# EAGLE design IndustrialUSBtoModbus (EAGLE 9.7.0)
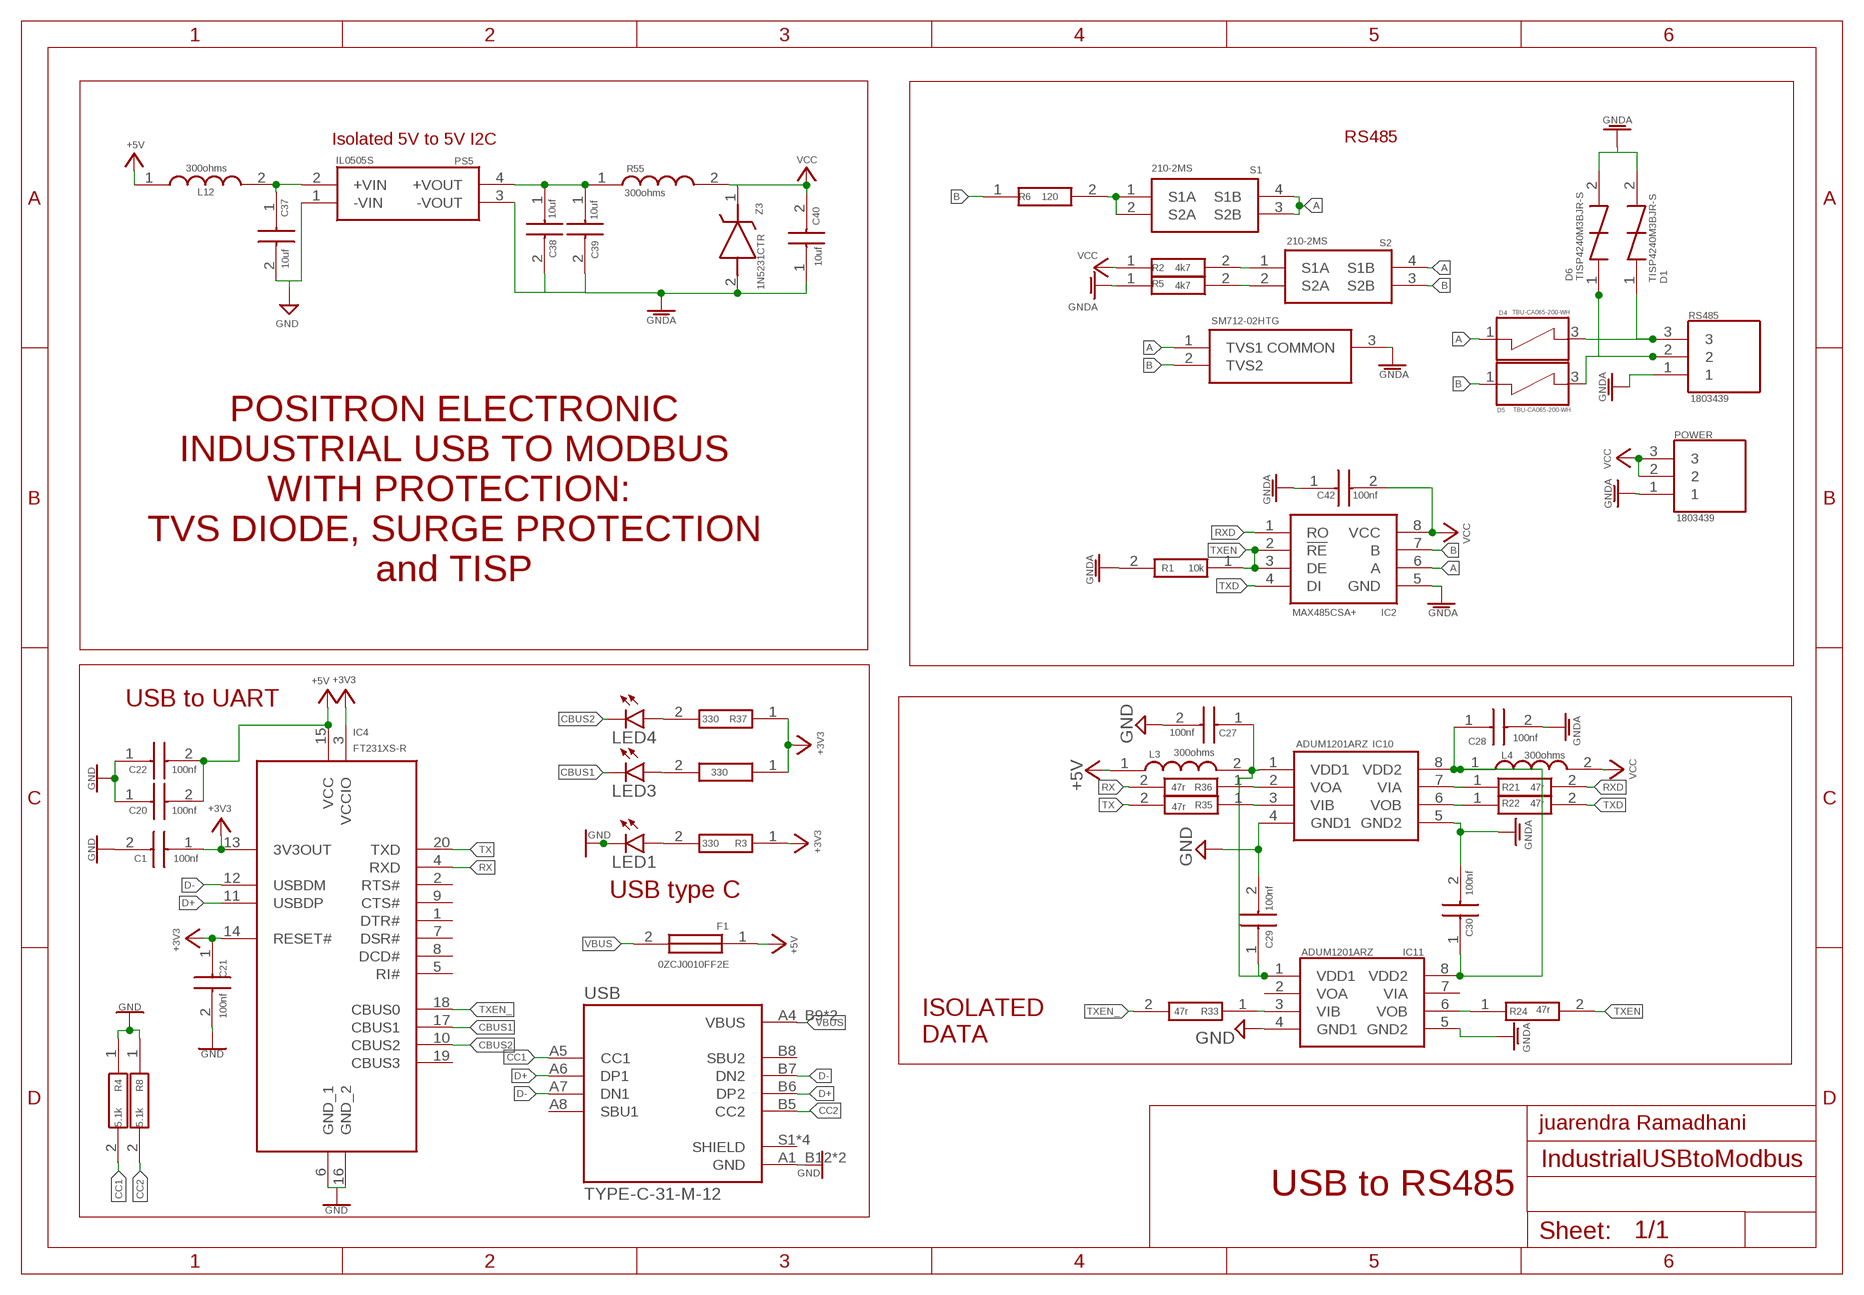
[diagram p0: schematic, sheet 1]

## Parts
C1  100nf  885012206071  [CAPC1608X87N]
C20  100nf  885012206071  [CAPC1608X87N]
C21  100nf  885012206071  [CAPC1608X87N]
C22  100nf  885012206071  [CAPC1608X87N]
C27  100nf  885012206071  [CAPC1608X87N]
C28  100nf  885012206071  [CAPC1608X87N]
C29  100nf  885012206071  [CAPC1608X87N]
C30  100nf  885012206071  [CAPC1608X87N]
C37  10uf  VJ1206G106KXXTW1BC  [CAPC3216X170N]
C38  10uf  VJ1206G106KXXTW1BC  [CAPC3216X170N]
C39  10uf  VJ1206G106KXXTW1BC  [CAPC3216X170N]
C40  10uf  VJ1206G106KXXTW1BC  [CAPC3216X170N]
C42  100nf  885012206071  [CAPC1608X87N]
D1  TISP4240M3BJR-S  [TISP4240M3BJRS]
D2  SM712-02HTG  [SOT95P237X111-3N]
D4  TBU-CA065-200-WH  [DIOC650X400X100N]
D5  TBU-CA065-200-WH  [DIOC650X400X100N]
D6  TISP4240M3BJR-S  [TISP4240M3BJRS]
F1  0ZCJ0010FF2E  [FUSC3216X75N]
IC2  MAX485CSA+  [SOIC127P600X175-8N]
IC4  FT231XS-R  [SOP64P599X175-20N]
IC10  ADUM1201ARZ  [SOIC127P600X175-8N]
IC11  ADUM1201ARZ  [SOIC127P600X175-8N]
L3  300ohms  MMZ1608B301CTAH0  [INDC1608X95N]
L4  300ohms  MMZ1608B301CTAH0  [INDC1608X95N]
L12  300ohms  MMZ1608B301CTAH0  [INDC1608X95N]
LED1  LED3MM  [LED3MM]
LED3  LED3MM  [LED3MM]
LED4  LED3MM  [LED3MM]
POWER  1803439  [1803439]
PS5  IL0505S  [IL0505S]
R1  10k  ERJ-3EKF1002V  [ERJ3EK_(0603)]
R2  4k7  ESR10EZPJ121  [RESC2012X65N]
R3  330  ERJ-H3EF3300V  [ERJH3]
R4  5.1k  ERJ-H3EF3300V  [ERJH3]
R5  4k7  ESR10EZPJ121  [RESC2012X65N]
R6  120  ESR10EZPJ121  [RESC2012X65N]
R8  5.1k  ERJ-H3EF3300V  [ERJH3]
R21  47r  ERJ-PA3J470V  [RESC1608X55N]
R22  47r  ERJ-PA3J470V  [RESC1608X55N]
R24  47r  ERJ-PA3J470V  [RESC1608X55N]
R33  47r  ERJ-PA3J470V  [RESC1608X55N]
R35  47r  ERJ-PA3J470V  [RESC1608X55N]
R36  47r  ERJ-PA3J470V  [RESC1608X55N]
R37  330  ERJ-H3EF3300V  [ERJH3]
R38  330  ERJ-H3EF3300V  [ERJH3]
R55  300ohms  MMZ1608B301CTAH0  [INDC1608X95N]
RS485  1803439  [1803439]
S1  210-2MS  [DIP775W63P254L655H458Q4N]
S2  210-2MS  [DIP775W63P254L655H458Q4N]
USB  TYPE-C-31-M-12  [HRO_TYPE-C-31-M-12]
Z3  1N5231CTR  [DIOAD1068W53L380D172]

## Nets
+3V3: C1.1 C21.1 IC4.3(VCCIO) IC4.13(3V3OUT) IC4.14(RESET#) R3.1 R37.1 R38.1
+5V: C20.2 C22.2 F1.1 IC4.15(VCC) L3.1 L12.1
A: D2.1(TVS1) D4.1 IC2.6(A) S1.3(S2B) S1.4(S1B) S2.4(S1B)
B: D2.2(TVS2) D5.1 IC2.7(B) R6.1 S2.3(S2B)
CBUS1: IC4.17(CBUS1) LED3.K(C)
CBUS2: IC4.10(CBUS2) LED4.K(C)
CC1: R4.2 USB.A5(CC1)
CC2: R8.2 USB.B5(CC2)
D+: IC4.11(USBDP) USB.A6(DP1) USB.B6(DP2)
D-: IC4.12(USBDM) USB.A7(DN1) USB.B7(DN2)
GND: C1.2 C20.1 C21.2 C22.1 C27.2 C29.2 C37.2 IC4.6(GND_1) IC4.16(GND_2) IC10.4(GND1) IC11.4(GND1) LED1.K(C) PS5.1(-VIN) R4.1 R8.1 USB.A1_B12(GND) USB.B1_A12(GND)
GNDA: C28.2 C30.2 C38.2 C39.2 C40.1 C42.1 D1.2 D2.3(COMMON) D6.2 IC2.5(GND) IC10.5(GND2) IC11.5(GND2) POWER.1 PS5.3(-VOUT) R1.2 R5.1 RS485.1 Z3.2(A)
N$1: C28.1 C30.1 IC10.8(VDD2) IC11.8(VDD2) L4.1
N$2: IC10.6(VOB) R22.1
N$3: LED3.A R38.2
N$4: IC10.7(VIA) R21.1
N$5: R2.2 S2.1(S1A)
N$6: R5.2 S2.2(S2A)
N$7: D5.3 D6.1 RS485.2
N$9: LED1.A R3.2
N$10: D1.1 D4.3 RS485.3
N$15: R6.2 S1.1(S1A) S1.2(S2A)
N$38: LED4.A R37.2
N$43: C27.1 C29.1 IC10.1(VDD1) IC11.1(VDD1) L3.2
N$47: IC10.3(VIB) R35.1
N$48: IC10.2(VOA) R36.1
N$54: IC11.6(VOB) R24.1
N$64: IC11.3(VIB) R33.1
N$85: C37.1 L12.2 PS5.2(+VIN)
N$86: C38.1 C39.1 PS5.4(+VOUT) R55.1
RX: IC4.4(RXD) R36.2
RXD: IC2.1(RO) R21.2
TX: IC4.20(TXD) R35.2
TXD: IC2.4(DI) R22.2
TXEN: IC2.2(!RE) IC2.3(DE) R1.1 R24.2
TXEN_: IC4.18(CBUS0) R33.2
VBUS: F1.2 USB.A4_B9(VBUS) USB.B4_A9(VBUS)
VCC: C40.2 C42.2 IC2.8(VCC) L4.2 POWER.2 POWER.3 R2.1 R55.2 Z3.1(K)
Unconnected: IC4.1(DTR#) IC4.2(RTS#) IC4.5(RI#) IC4.7(DSR#) IC4.8(DCD#) IC4.9(CTS#) IC4.19(CBUS3) IC11.2(VOA) IC11.7(VIA) USB.A8(SBU1) USB.B8(SBU2) USB.S1(SHIELD) USB.S2(SHIELD) USB.S3(SHIELD) USB.S4(SHIELD)

## Notes on the sheet
- Isolated 5V to 5V I2C | RS485
- POSITRON ELECTRONIC
  INDUSTRIAL USB TO MODBUS
  WITH PROTECTION: 
  TVS DIODE, SURGE PROTECTION
  and TISP
- USB to UART
- USB type C
- ISOLATED
  DATA
- juarendra Ramadhani
- USB to RS485

## Library data of the parts
C1 C20-C22 C42 = AKCP:885012206071: Wurth Elektronik 0603 WCAP-CSGP 100nF Ceramic Multilayer Capacitor, 25 V dc, +125C, X7R Dielectric, +/-10% Source: Datasheet <https://katalog.we-online.com/pbs/datasheet/885012206071.pdf>; DESCRIPTION: Wurth Elektronik 0603 WCAP-CSGP 100nF Ceramic Multilayer Capacitor, 25 V dc, +125C, X7R Dielectric, +/-10%; DIGIKEY_PARTNUMBER: 732-7989-1-ND; DIGIKEY_PRICE-STOCK: https://www.digikey.com/product-detail/en/w%C3%BCrth-elektronik/885012206071/732-7989-1-ND/5454616; HEIGHT: 0.87mm; MANUFACTURER_NAME: Wurth Elektronik; MANUFACTURER_PART_NUMBER: 885012206071; MOUSER_PART_NUMBER: 710-885012206071; MOUSER_PRICE-STOCK: https://www.mouser.co.uk/ProductDetail/Wurth-Elektronik/885012206071?qs=0KOYDY2FL2%2FEBQkuHgvarg%3D%3D
C27-C30 = Raritan Base:885012206071: Wurth Elektronik 0603 WCAP-CSGP 100nF Ceramic Multilayer Capacitor, 25 V dc, +125C, X7R Dielectric, +/-10% Source: Datasheet <https://katalog.we-online.com/pbs/datasheet/885012206071.pdf>; DESCRIPTION: Wurth Elektronik 0603 WCAP-CSGP 100nF Ceramic Multilayer Capacitor, 25 V dc, +125C, X7R Dielectric, +/-10%; DIGIKEY_PARTNUMBER: 732-7989-1-ND; DIGIKEY_PRICE-STOCK: https://www.digikey.com/product-detail/en/w%C3%BCrth-elektronik/885012206071/732-7989-1-ND/5454616; HEIGHT: 0.87mm; MANUFACTURER_NAME: Wurth Elektronik; MANUFACTURER_PART_NUMBER: 885012206071; MOUSER_PART_NUMBER: 710-885012206071; MOUSER_PRICE-STOCK: https://www.mouser.co.uk/ProductDetail/Wurth-Elektronik/885012206071?qs=0KOYDY2FL2%2FEBQkuHgvarg%3D%3D
C37-C40 = SamacSys_Parts:VJ1206G106KXXTW1BC: Multilayer Ceramic Capacitors MLCC - SMD/SMT 10uF 25volts 10% Source: Datasheet <http://www.vishay.com/docs/45200/vjhirelseries.pdf>; DESCRIPTION: Multilayer Ceramic Capacitors MLCC - SMD/SMT 10uF 25volts 10%; HEIGHT: 1.7mm; MANUFACTURER_NAME: Vishay; MANUFACTURER_PART_NUMBER: VJ1206G106KXXTW1BC; MOUSER_PART_NUMBER: 77-VJ126G106KXXTW1BC; MOUSER_PRICE-STOCK: https://www.mouser.co.uk/ProductDetail/Vishay-Vitramon/VJ1206G106KXXTW1BC?qs=%252BqhDFMvZazSFJ5Hhl5VYQw%3D%3D
D1 D6 = TISP4240M3BJR-S:TISP4240M3BJR-S: BOURNS - TISP4240M3BJR-S - THYRISTOR, O.VOLT. PROT., 180V, SMB Source: Datasheet <http://html.alldatasheet.com/html-pdf/160733/BOURNS/TISP4240M3BJR-S/2984/13/TISP4240M3BJR-S.html>; DESCRIPTION: BOURNS - TISP4240M3BJR-S - THYRISTOR, O.VOLT. PROT., 180V, SMB; HEIGHT: 2.4mm; MANUFACTURER_NAME: Bourns; MANUFACTURER_PART_NUMBER: TISP4240M3BJR-S; MOUSER_PART_NUMBER: 652-TISP4240M3BJR-S; MOUSER_PRICE-STOCK: https://www.mouser.co.uk/ProductDetail/Bourns/TISP4240M3BJR-S?qs=0zoXPJiSMmNlDn5QEdP1vg%3D%3D
D2 = SamacSys_Parts:SM712-02HTG: ESD Suppressors / TVS Diodes 600W 2 Channel Green Asymmetrical SOT23-3 Source: Datasheet; DESCRIPTION: ESD Suppressors / TVS Diodes 600W 2 Channel Green Asymmetrical SOT23-3; DIGIKEY_PARTNUMBER: F6450CT-ND; DIGIKEY_PRICE-STOCK: https://www.digikey.com/product-detail/en/littelfuse-inc/SM712-02HTG/F6450CT-ND/5019610; HEIGHT: 1.11mm; MANUFACTURER_NAME: LITTELFUSE; MANUFACTURER_PART_NUMBER: SM712-02HTG; MOUSER_PART_NUMBER: 576-SM712-02HTG; MOUSER_PRICE-STOCK: https://www.mouser.co.uk/ProductDetail/Littelfuse/SM712-02HTG?qs=aGgfWYEhH7lQgBVBPCUDkw%3D%3D
D4 D5 = TBU-CA065-200-WH:TBU-CA065-200-WH: TBU-CA065-200-WH, Bi-Directional TVS Diode, 12-Pin DFN Check availability <https://pricing.snapeda.com/parts/TBU-CA065-200-WH/Bourns/view-part?ref=eda>; AVAILABILITY: In Stock; CHECK_PRICES: https://www.snapeda.com/parts/TBU-CA065-200-WH/Bourns+-+J.W.+Miller/view-part/?ref=eda; DESCRIPTION: A Single Bi-Directional, 650V, 200mA, 3-Pin DFN pkg TBU | Bourns TBU-CA065-200-WH; MF: Bourns; MP: TBU-CA065-200-WH; PACKAGE: SMD-4 Bourns; PRICE: None; PURCHASE-URL: https://www.snapeda.com/api/url_track_click_mouser/?unipart_id=587286&manufacturer=Bourns&part_name=TBU-CA065-200-WH&search_term=None; SNAPEDA_LINK: https://www.snapeda.com/parts/TBU-CA065-200-WH/Bourns+-+J.W.+Miller/view-part/?ref=snap
F1 = AccesControlNFC:0ZCJ0010FF2E: Resettable Fuses - PPTC Fuse Source: Datasheet <https://componentsearchengine.com/Datasheets/1/0ZCJ0010FF2E.pdf>; DESCRIPTION: Resettable Fuses - PPTC Fuse; HEIGHT: 0.75mm; MANUFACTURER_NAME: Stewart Connector; MANUFACTURER_PART_NUMBER: 0ZCJ0010FF2E; MOUSER_PART_NUMBER: 530-0ZCJ0010FF2E; MOUSER_PRICE-STOCK: https://www.mouser.co.uk/ProductDetail/Bel-Fuse/0ZCJ0010FF2E?qs=SRYZG9HaIQ2ZPdy0ahZ08g%3D%3D
IC2 = AKCP:MAX485CSA+: MAX485CSA+, Line Transceiver, RS-485, RS-422 2.5Mbit/s Differential, 5V, 8-Pin SOIC Source: Datasheet <http://datasheets.maximintegrated.com/en/ds/MAX1487-MAX491.pdf>; DESCRIPTION: MAX485CSA+, Line Transceiver, RS-485, RS-422 2.5Mbit/s Differential, 5V, 8-Pin SOIC; HEIGHT: 1.75mm; MANUFACTURER_NAME: Maxim Integrated; MANUFACTURER_PART_NUMBER: MAX485CSA+; MOUSER_PART_NUMBER: 700-MAX485CSA; MOUSER_PRICE-STOCK: https://www.mouser.co.uk/ProductDetail/Maxim-Integrated/MAX485CSA%2b?qs=1THa7WoU59EQmpurcwoy4Q%3D%3D
IC4 = AKCP:FT231XS-R: FTDI Chip FT231XS-R, Interface RS232, RS422, RS485, SIE, UART 3MBd, 5 V, 20-pin, SSOP Source: Datasheet; DESCRIPTION: FTDI Chip FT231XS-R, Interface RS232, RS422, RS485, SIE, UART 3MBd, 5 V, 20-pin, SSOP; HEIGHT: 1.753mm; MANUFACTURER_NAME: FTDI Chip; MANUFACTURER_PART_NUMBER: FT231XS-R; MOUSER_PART_NUMBER: 895-FT231XS-R; MOUSER_PRICE-STOCK: https://www.mouser.co.uk/ProductDetail/FTDI/FT231XS-R?qs=Gp1Yz1mis3WduRPsgrTbtg%3D%3D
IC10 IC11 = Raritan Base:ADUM1201ARZ: Dual-Channel Digital Isolators Source: Datasheet <http://componentsearchengine.com/Datasheets/1/ADUM1201ARZ.pdf>; DESCRIPTION: Dual-Channel Digital Isolators; HEIGHT: 1.75mm; MANUFACTURER_NAME: Analog Devices; MANUFACTURER_PART_NUMBER: ADUM1201ARZ; MOUSER_PART_NUMBER: 584-ADUM1201ARZ; MOUSER_PRICE-STOCK: https://www.mouser.co.uk/ProductDetail/Analog-Devices/ADUM1201ARZ?qs=WIvQP4zGanhnZkk5OvV4Vw%3D%3D
L3 L4 L12 R55 = Raritan Base:MMZ1608B301CTAH0: Ferrite Beads Multi-Layer 300Ohm 25% 100MHz 500mA 250mOhm DCR 0603 T/R Source: Datasheet <https://www.arrow.com/en/products/mmz1608b301ctah0/tdk>; ARROW_PART_NUMBER: MMZ1608B301CTAH0; DESCRIPTION: Ferrite Beads Multi-Layer 300Ohm 25% 100MHz 500mA 250mOhm DCR 0603 T/R; HEIGHT: 0.95mm; MANUFACTURER_NAME: TDK; MANUFACTURER_PART_NUMBER: MMZ1608B301CTAH0
LED1 LED3 LED4 = led:LED: LED OSRAM: - CHIPLED LG R971, LG N971, LY N971, LG Q971, LY Q971, LO R971, LY R971 LH N974, LH R974 LS Q976, LO Q976, LY Q976 LO Q996 - Hyper CHIPLED LW Q18S LB Q993, LB Q99A, LB R99A - SideLED LS A670, LO A670, LY A670, LG A670, LP A670 LB A673, LV A673, LT A673, LW A673 LH A674 LY A675 LS A676, LA A676, LO A676, LY A676, LW A676 LS A679, LY A679, LG A679 - Hyper Micro SIDELED® LS Y876, LA Y876, LO Y876, LY Y876 LT Y87S - SmartLED LW L88C, LW L88S LB L89C, LB L89S, LG L890 LS L89K, LO L89K, LY L89K LS L896, LA L896, LO L896, LY L896 - TOPLED LS T670, LO T670, LY T670, LG T670, LP T670 LSG T670, LSP T670, LSY T670, LOP T670, LYG T670 LG T671, LOG T671, LSG T671 LB T673, LV T673, LT T673, LW T673 LH T674 LS T676, LA T676, LO T676, LY T676, LB T676, LH T676, LSB T676, LW T676 LB T67C, LV T67C, LT T67C, LS T67K, LO T67K, LY T67K, LW E67C LS E67B, LA E67B, LO E67B, LY E67B, LB E67C, LV E67C, LT E67C LW T67C LS T679, LY T679, LG T679 LS T770, LO T770, LY T770, LG T770, LP T770 LB T773, LV T773, LT T773, LW T773 LH T774 LS E675, LA E675, LY E675, LS T675 LS T776, LA T776, LO T776, LY T776, LB T776 LHGB T686 LT T68C, LB T68C - Hyper Mini TOPLED® LB M676 - Mini TOPLED Santana® LG M470 LS M47K, LO M47K, LY M47K Source: http://www.osram.convergy.de LUXEON: - LUMILED® LXK2-PW12-R00, LXK2-PW12-S00, LXK2-PW14-U00, LXK2-PW14-V00 LXK2-PM12-R00, LXK2-PM12-S00, LXK2-PM14-U00 LXK2-PE12-Q00, LXK2-PE12-R00, LXK2-PE12-S00, LXK2-PE14-T00, LXK2-PE14-U00 LXK2-PB12-K00, LXK2-PB12-L00, LXK2-PB12-M00, LXK2-PB14-N00, LXK2-PB14-P00, LXK2-PB14-Q00 LXK2-PR12-L00, LXK2-PR12-M00, LXK2-PR14-Q00, LXK2-PR14-R00 LXK2-PD12-Q00, LXK2-PD12-R00, LXK2-PD12-S00 LXK2-PH12-R00, LXK2-PH12-S00 LXK2-PL12-P00, LXK2-PL12-Q00, LXK2-PL12-R00 Source: www.luxeon.com KINGBRIGHT: KA-3528ASYC Source: www.kingbright.com
POWER RS485 = 1803439:1803439: 3 way vertical PCB header,3.81mm pitch Phoenix Contact MCV Series, 3.81mm Pitch 3 Way 1 Row Straight PCB Header, Solder Termination, 8A Source: Datasheet; DESCRIPTION: 3 way vertical PCB header,3.81mm pitch Phoenix Contact MCV Series, 3.81mm Pitch 3 Way 1 Row Straight PCB Header, Solder Termination, 8A; HEIGHT: mm; MANUFACTURER_NAME: Phoenix Contact; MANUFACTURER_PART_NUMBER: 1803439; MOUSER_PART_NUMBER: 651-1803439; MOUSER_PRICE-STOCK: https://www.mouser.co.uk/ProductDetail/Phoenix-Contact/1803439?qs=ChwaSN6Xm4%2FKqu7eZUAe4w%3D%3D
PS5 = IL0505S:IL0505S: DC/DC Converter Isolated 5V 2W XP Power Through Hole 2W Isolated DC-DC Converter, Vin 4.5 5.5 V dc, I/O isolation 1000V dc, Vout 5V dc Source: Datasheet <https://www.xppower.com/portals/0/pdfs/SF_IL.pdf>; DESCRIPTION: DC/DC Converter Isolated 5V 2W XP Power Through Hole 2W Isolated DC-DC Converter, Vin 4.5 5.5 V dc, I/O isolation 1000V dc, Vout 5V dc; HEIGHT: mm; MANUFACTURER_NAME: XP POWER; MANUFACTURER_PART_NUMBER: IL0505S; MOUSER_PART_NUMBER: 209-IL0505S; MOUSER_PRICE-STOCK: https://www.mouser.co.uk/ProductDetail/XP-Power/IL0505S?qs=w%2Fv1CP2dgqqMDzpB%252BgTJVA%3D%3D
R1 = AKCP:ERJ-3EKF1002V: Thick Film Resistors - SMD 0603 10Kohms 1% AEC-Q200 Source: Datasheet <https://industrial.panasonic.com/cdbs/www-data/pdf/RDA0000/AOA0000C304.pdf>; DESCRIPTION: Thick Film Resistors - SMD 0603 10Kohms 1% AEC-Q200; HEIGHT: 0.55mm; MANUFACTURER_NAME: Panasonic; MANUFACTURER_PART_NUMBER: ERJ-3EKF1002V; MOUSER_PART_NUMBER: 667-ERJ-3EKF1002V; MOUSER_PRICE-STOCK: https://www.mouser.co.uk/ProductDetail/Panasonic/ERJ-3EKF1002V?qs=H7k1u0Mp9JSrGPQ5%2F5COuw%3D%3D
R2 R5 R6 = SamacSys_Parts:ESR10EZPJ121: Thick Film Resistors - SMD 0805 120ohm 5% Anti Surge AEC-Q200 Source: Datasheet <https://ms.componentsearchengine.com/Datasheets/1/ESR10EZPJ121.pdf>; ARROW_PART_NUMBER: ESR10EZPJ121; DESCRIPTION: Thick Film Resistors - SMD 0805 120ohm 5% Anti Surge AEC-Q200; DIGIKEY_PARTNUMBER: RHM120KCT-ND; DIGIKEY_PRICE-STOCK: https://www.digikey.com/product-detail/en/rohm-semiconductor/ESR10EZPJ121/RHM120KCT-ND/1762959; HEIGHT: 0.65mm; MANUFACTURER_NAME: ROHM Semiconductor; MANUFACTURER_PART_NUMBER: ESR10EZPJ121; MOUSER_PART_NUMBER: 755-ESR10EZPJ121; MOUSER_PRICE-STOCK: https://www.mouser.co.id/ProductDetail/ROHM-Semiconductor/ESR10EZPJ121?qs=%2Fha2pyFadui7JatYYUNpFhsZLPns7z%252BGDgMyY6tORV%2FueGFgrTXlFg%3D%3D; SPICEPREFIX: R
R3 R37 R38 = AKCP:ERJ-H3EF3300V: Power Rating 0.125W,Resistance 330 Ohm,LxW(EIA) 1.6 x 0.8 (EIA:0603) mm Source: Datasheet <http://industrial.panasonic.com/cdbs/www-data/pdf/RDQ0000/ast-ind-151033.pdf>; DESCRIPTION: Power Rating 0.125W,Resistance 330 Ohm,LxW(EIA) 1.6 x 0.8 (EIA:0603) mm; HEIGHT: mm; MANUFACTURER_NAME: Panasonic; MANUFACTURER_PART_NUMBER: ERJ-H3EF3300V; MOUSER_PART_NUMBER: 667-ERJ-H3EF3300V; MOUSER_PRICE-STOCK: https://www.mouser.co.uk/ProductDetail/Panasonic/ERJ-H3EF3300V?qs=eP2BKZSCXI61roRLPi8W7w%3D%3D
R4 R8 = AKCP:ERJ-H3EF3300V: Power Rating 0.125W,Resistance 330 Ohm,LxW(EIA) 1.6 x 0.8 (EIA:0603) mm Source: Datasheet <http://industrial.panasonic.com/cdbs/www-data/pdf/RDQ0000/ast-ind-151033.pdf>; DESCRIPTION: Power Rating 0.125W,Resistance 330 Ohm,LxW(EIA) 1.6 x 0.8 (EIA:0603) mm; HEIGHT: mm; MANUFACTURER_NAME: Panasonic; MANUFACTURER_PART_NUMBER: ERJ-H3EF3300V; MOUSER_PART_NUMBER: 667-ERJ-H3EF3300V; MOUSER_PRICE-STOCK: https://www.mouser.co.uk/ProductDetail/Panasonic/ERJ-H3EF3300V?qs=eP2BKZSCXI61roRLPi8W7w%3D%3D; VALUE: 330
R21 R22 R24 R33 R35 R36 = Raritan Base:ERJ-PA3J470V: ERJ-PA3J470V Source: Datasheet <https://industrial.panasonic.com/cdbs/www-data/pdf/RDO0000/AOA0000C331.pdf>; DESCRIPTION: ERJ-PA3J470V; DIGIKEY_PARTNUMBER: P47.00BZCT-ND; DIGIKEY_PRICE-STOCK: https://www.digikey.com/product-detail/en/panasonic-electronic-components/ERJ-PA3J470V/P47-00BZCT-ND/5036330; HEIGHT: 0.55mm; MANUFACTURER_NAME: Panasonic; MANUFACTURER_PART_NUMBER: ERJ-PA3J470V; MOUSER_PART_NUMBER: 667-ERJ-PA3J470V; MOUSER_PRICE-STOCK: https://www.mouser.co.id/ProductDetail/Panasonic/ERJ-PA3J470V?qs=%2Fha2pyFadujfhmhVngkC6%252BrB%252BD0htnOagRQnEO%2FGREZyJH21elijFg%3D%3D
S1 S2 = SamacSys_Parts:210-2MS: DIP Switches / SIP Switches 2 switch sections SPST Source: Datasheet <https://componentsearchengine.com/Datasheets/1/210-2MS.pdf>; DESCRIPTION: DIP Switches / SIP Switches 2 switch sections SPST; HEIGHT: 4.58mm; MANUFACTURER_NAME: CTS; MANUFACTURER_PART_NUMBER: 210-2MS; MOUSER_PART_NUMBER: 774-2102MS; MOUSER_PRICE-STOCK: https://www.mouser.com/Search/Refine.aspx?Keyword=774-2102MS; SPICEPREFIX: S
USB = TYPE-C-31-M-12:TYPE-C-31-M-12: Check availability <https://pricing.snapeda.com/parts/TYPE-C-31-M-12/HRO%20Electronics%20Co.%2C%20Ltd./view-part?ref=eda>; AVAILABILITY: Not in stock; CHECK_PRICES: https://www.snapeda.com/parts/TYPE-C-31-M-12/HRO+Electronics+Co.%252C+Ltd./view-part/?ref=eda; DESCRIPTION: USB Connectors 24 Receptacle 1 8.94*7.3mm RoHS; MF: HRO Electronics Co., Ltd.; MP: TYPE-C-31-M-12; PACKAGE: Package; PRICE: None; SNAPEDA_LINK: https://www.snapeda.com/parts/TYPE-C-31-M-12/HRO+Electronics+Co.%252C+Ltd./view-part/?ref=snap
Z3 = SamacSys_Parts:1N5231CTR: Zener Diodes Source: Datasheet <https://componentsearchengine.com/Datasheets/1/1N5231CTR.pdf>; DESCRIPTION: Zener Diodes; DIGIKEY_PARTNUMBER: 1N5231CTRCT-ND; DIGIKEY_PRICE-STOCK: https://www.digikey.com/product-detail/en/on-semiconductor/1N5231CTR/1N5231CTRCT-ND/3907881; HEIGHT: mm; MANUFACTURER_NAME: ON Semiconductor; MANUFACTURER_PART_NUMBER: 1N5231CTR; MOUSER_PART_NUMBER: 512-1N5231CTR; MOUSER_PRICE-STOCK: https://www.mouser.com/Search/Refine.aspx?Keyword=512-1N5231CTR

## Board
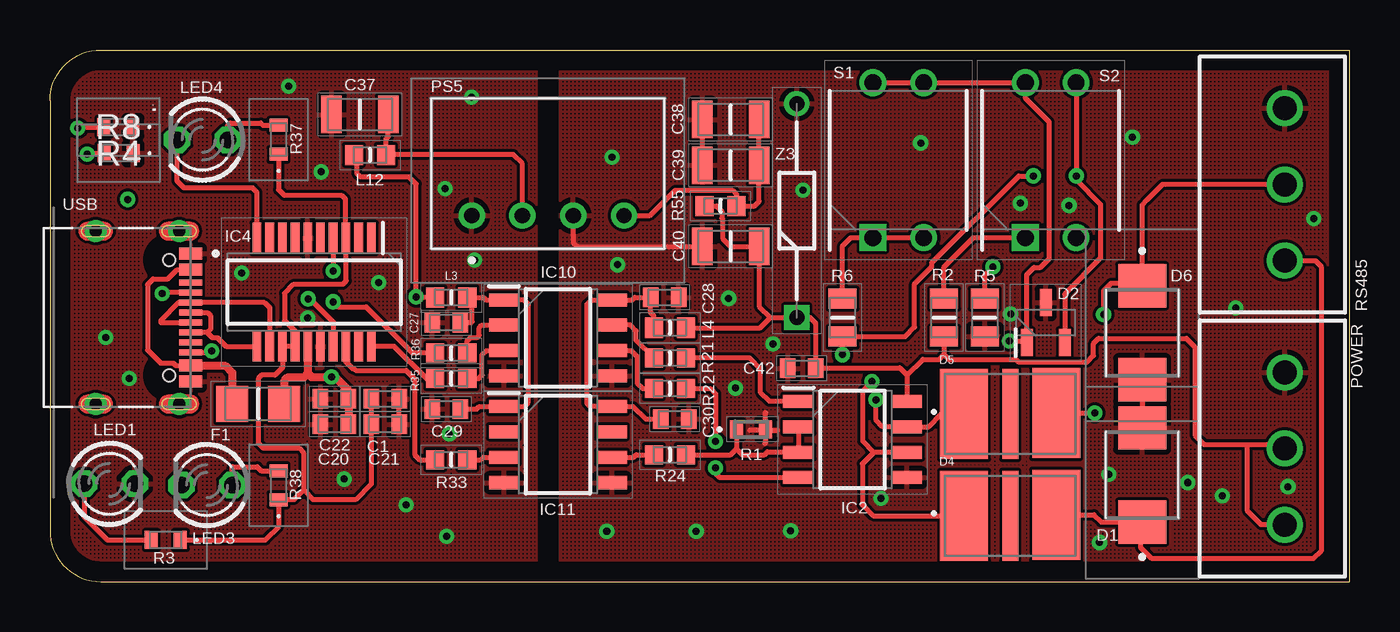
[diagram p1: board, top side]
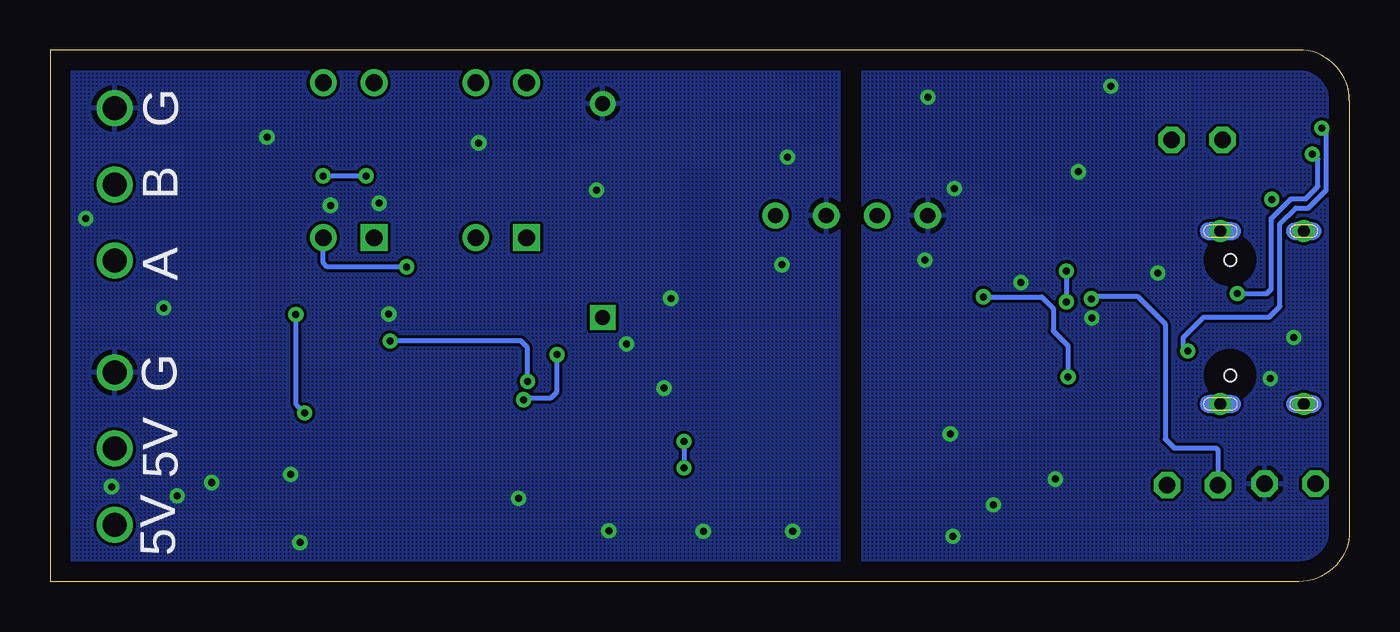
[diagram p2: board, bottom side, seen from below]

Size 64.97 x 26.59 mm. Coordinates in mm from the lower left corner, seen from the top.
Outline: 2.54,0 64.97,0 64.97,26.59 2.54,26.59 arc90 0,24.05 0,2.54 arc90 2.54,0
Copper layers (1*16): Top 0.035mm / dielectric 1.5mm / Bottom 0.035mm
Design rules "Fusion Electronics Design Rules": minimum track width 10mil, minimum drill 0.35mm, track to track 6mil, track to pad 6mil, pad to pad 6mil, via to via 6mil, smd to smd 6mil, copper to edge 40mil, drill to drill 6mil, minimum pad ring 10mil, minimum via ring 8mil, stop-mask expansion 4mil, vias tented up to drill 0.36mm, thermal gap 10mil

### Footprints (pad centres in the part's own frame; a part is rotated, then mirrored left to right if it is on the bottom)
CAPC1608X87N = smd 0.78 x 0.98: 1 -0.7,0; 2 0.7,0
CAPC3216X170N = smd 1.03 x 1.87: 1 -1.42,0; 2 1.42,0
TISP4240M3BJRS = smd 2.16 x 2.4: 1 -2.35,0; 2 2.35,0
SOT95P237X111-3N = smd 1.35 x 0.6: 1 -1,0.95; 2 -1,-0.95; 3 1,0
DIOC650X400X100N = smd 2.4 x 4.5: 1 -2.3,0; 3 2.3,0.05 | smd 0.8 x 4.5: 2 0,0
FUSC3216X75N = smd 1.61 x 1.82: 1 -1.3,0; 2 1.3,0
SOIC127P600X175-8N = smd 1.525 x 0.65: 1 -2.712,1.905; 2 -2.712,0.635; 3 -2.712,-0.635; 4 -2.712,-1.905; 5 2.712,-1.905; 6 2.712,-0.635; 7 2.712,0.635; 8 2.712,1.905
SOP64P599X175-20N = smd 1.526 x 0.435: 1 -2.712,2.858; 2 -2.712,2.222; 3 -2.712,1.588; 4 -2.712,0.952; 5 -2.712,0.318; 6 -2.712,-0.318; 7 -2.712,-0.952; 8 -2.712,-1.588; 9 -2.712,-2.222; 10 -2.712,-2.858; 11 2.712,-2.858; 12 2.712,-2.222; 13 2.712,-1.588; 14 2.712,-0.952; 15 2.712,-0.318; 16 2.712,0.318; 17 2.712,0.952; 18 2.712,1.588; 19 2.712,2.222; 20 2.712,2.858
SOIC127P600X175-8N' = smd 1.5 x 0.65: 1 -2.7,1.905; 2 -2.7,0.635; 3 -2.7,-0.635; 4 -2.7,-1.905; 5 2.7,-1.905; 6 2.7,-0.635; 7 2.7,0.635; 8 2.7,1.905
INDC1608X95N = smd 0.9 x 1: 1 -0.8,0; 2 0.8,0
LED3MM = drill 0.813 octagon: A -1.27,0; K 1.27,0
1803439 = drill 1.2 pad 1.8: 1 -7.62,0; 2 -3.81,0; 3 0,0
IL0505S = drill 0.77 pad 1.32: 1 -3.81,-1.755; 2 -1.27,-1.755; 3 1.27,-1.755; 4 3.81,-1.755
ERJ3EK_(0603) = smd 0.65 x 0.9: 1 -0.725,0; 2 0.725,0
RESC2012X65N = smd 1 x 1.4: 1 -0.95,0; 2 0.95,0
ERJH3 = smd 0.65 x 0.9: 1 -0.725,0; 2 0.725,0
RESC1608X55N = smd 0.9 x 0.95: 1 -0.8,0; 2 0.8,0
DIP775W63P254L655H458Q4N = drill 0.83 pad 1.23 square: 1 -3.875,1.27 | drill 0.83 pad 1.23: 2 -3.875,-1.27; 3 3.875,-1.27; 4 3.875,1.27
HRO_TYPE-C-31-M-12 = smd 0.6 x 1.14: A1_B12 -3.2,4.75; A4_B9 -2.4,4.75; B1_A12 3.2,4.75; B4_A9 2.4,4.75 | smd 0.3 x 1.14: A5 -1.25,4.75; A6 -0.25,4.75; A7 0.25,4.75; A8 1.25,4.75; B5 1.75,4.75; B6 0.75,4.75; B7 -0.75,4.75; B8 -1.75,4.75 | drill 0.6 pad 0.9: S1 -4.325,4.17; S2 4.325,4.17; S3 -4.325,0; S4 4.325,0 | hole 0.6: -2.89,3.68; 2.89,3.68
DIOAD1068W53L380D172 = drill 0.75 pad 1.15 square: 1 0,0 | drill 0.75 pad 1.15: 2 10.7,0

### Placement (x,y rotation side)
C1  16.76,9.14 0 top
C20  14.22,7.87 0 top
C21  16.76,7.87 0 top
C22  14.22,9.14 0 top
C27  19.81,12.95 180 top
C28  30.73,14.22 0 top
C29  19.81,8.64 180 top
C30  31.24,8.13 0 top
C37  15.49,23.37 180 top
C38  34.04,23.11 180 top
C39  34.04,20.83 180 top
C40  34.04,16.76 0 top
C42  37.59,10.67 0 top
D1  54.61,5.33 90 top
D2  49.78,12.95 90 top
D4  48.01,3.3 0 top
D5  48.01,8.38 0 top
D6  54.61,12.45 270 top
F1  10.41,8.89 180 top
IC2  40.13,7.11 0 top
IC4  13.21,14.48 270 top
IC10  ADUM1201ARZ  [SOIC127P600X175-8N']  25.4,12.19 0 top
IC11  ADUM1201ARZ  [SOIC127P600X175-8N']  25.4,6.86 0 top
L3  20.07,14.22 0 top
L4  30.99,12.7 0 top
L12  16,21.34 0 top
LED1  2.97,4.9 0 top
LED3  7.85,4.83 180 top
LED4  7.62,22.1 180 top
POWER  61.75,2.84 270 top
PS5  24.89,20.07 0 top
R1  35.05,7.62 0 top
R2  44.7,13.21 90 top
R3  5.79,2.08 180 top
R4  3.43,21.42 180 top
R5  46.74,13.21 90 top
R6  39.62,13.21 90 top
R8  3.42,22.74 180 top
R21  30.99,11.18 0 top
R22  30.99,9.65 0 top
R24  30.99,6.35 0 top
R33  20.07,6.1 180 top
R35  20.07,10.16 180 top
R36  20.07,11.43 180 top
R37  11.43,22.1 90 top
R38  11.43,4.83 90 top
R55  33.53,18.8 180 top
RS485  61.75,16.05 270 top
S1  42.42,21.08 90 top
S2  50.04,21.08 90 top
USB  2.29,13.21 270 top
Z3  37.34,13.21 90 top

### Tracks (layer width: path | path; a pad name or v marks a point on that pad's centre or on a via)
+3V3
  Top 0.254: C1.1 C21.1 16.06,4.89 15.28,4.1 13.13,4.1 13.13,4.13 12.68,4.58 | 11.46,4.1 12.19,4.1 12.68,4.58 | 11.46,4.1 R38.1 | R37.1 11.43,19.61 11.71,19.33 14.58,19.33 14.76,19.15 14.76,17.23 IC4.3 14.81,17.18 14.81,15.04 14.66,14.88 12.19,14.88 11.72,14.42 11.72,13.06 12.26,12.53 IC4.14 IC4.13 11.62,10.71 11.25,10.34 10.59,10.34 10.41,10.16 10.41,6.93 10.67,6.68 12.45,6.68 12.68,6.45 12.68,4.58 | R3.1 10.77,2.08 11.46,2.77 11.46,4.1
+5V  (via drill 0.35)
  Top 0.254: L3.1 19.24,14.25 v18.31,14.25 18.31,19.89 17.96,20.24 15.52,20.24 15.34,20.42 15.34,21.2 L12.1
  Top 0.406: F1.1 11.71,10.06 11.86,10.21 12.68,10.21 12.89,10.43 | IC4.15 12.89,10.43 | 12.89,10.43 13.08,10.24 v14.07,10.24 14.25,10.24 14.92,9.56 C22.2 C20.2
  Bottom 0.254: v18.31,14.25 15.39,14.25 14.81,13.67 14.81,12.55 14.07,11.81 v14.07,10.24
A  (via drill 0.35)
  Top 0.254: IC2.6 41.2,6.48 | 41.2,6.48 40.62,5.89 40.62,3.84 41.15,3.3 D4.1 | S1.4 S1.3 S2.4 48.77,24.18 49.96,22.99 49.96,16.15 49.53,15.72 49.2,15.72 48.83,15.36 D2.1 | D2.1 | 41.2,6.48 40.64,7.04 40.64,9.55 v41.1,10.01 | v47.97,12.04 48.76,12.04 D2.1
  Bottom 0.254: v41.1,10.01 41.1,11.71 41.43,12.04 v47.97,12.04
B  (via drill 0.35)
  Top 0.254: D5.1 44.58,8.38 43.94,7.75 IC2.7 41.63,7.75 41.3,8.08 v41.3,9.1 | S2.3 v51.31,20.3 51.31,20.09 52.53,18.87 52.53,16.18 50.73,14.39 D2.2 | v39.62,11.35 R6.1 42.76,12.26 43.23,12.72 43.23,14.89 44.09,15.76 44.09,15.95 48.44,20.3 v49.17,20.3
  Bottom 0.254: v41.3,9.1 41.2,9.19 39.93,9.19 39.62,9.5 v39.62,11.35 | v49.17,20.3 v51.31,20.3
CBUS1  (via drill 0.35)
  Top 0.254: IC4.17 14.16,12.99 13.01,14.15 v12.91,14.15
  Bottom 0.254: v12.91,14.15 12.79,14.28 10.62,14.28 9.22,12.88 9.22,7.14 8.76,6.68 6.68,6.68 6.58,6.58 LED3.K
CBUS2
  Top 0.254: IC4.10 10.35,19.47 10.13,19.69 6.71,19.69 6.35,20.04 LED4.K
CC1  (via drill 0.35)
  Top 0.254: USB.A5 5.67,14.46 v5.61,14.4 | v1.85,21.39 1.89,21.42 R4.2
  Bottom 0.254: v5.61,14.4 4.14,14.4 3.91,14.63 3.91,18.16 2.92,19.15 2.18,19.15 1.57,19.76 1.57,21.13 1.83,21.39 v1.85,21.39
CC2  (via drill 0.35)
  Top 0.254: USB.B5 7.88,11.46 7.96,11.54 v8.09,11.54 | v1.39,22.68 1.46,22.75 R8.2
  Bottom 0.254: v8.09,11.54 8.31,11.76 8.31,12.22 7.29,13.23 4.01,13.23 3.48,13.77 3.48,17.91 2.69,18.69 2.06,18.69 1.17,19.58 1.17,22.46 v1.39,22.68
D+
  Top 0.254: USB.A6 7.88,13.46 8.03,13.31 8.03,12.62 7.86,12.46 | 7.86,12.46 USB.B6 | 7.86,12.46 8.12,12.2 8.36,12.2 8.8,11.77 IC4.11
D-
  Top 0.254: USB.A7 5.54,12.95 5.54,13.07 6.42,13.96 USB.B7 10.73,13.96 10.99,13.7 IC4.12
GND  (via drill 0.35)
  Top 0.254: C21.2 C1.2
  other vias: 19.84,2.26 17.81,3.84 3.96,10.16 2.79,12.22 9.58,15.44 11.94,24.79 13.56,20.5 21.08,24.23 19.76,19.66 16.43,14.96 21.23,16.08 14.71,5.13 19.96,7.39 12.88,13.18
  pour Top (hatched): 0,27.2 0,0.66 0.66,0 24.33,0 24.33,27.1 24.16,27.27 24.16,27.27 24.08,27.36 0.15,27.36
  pour Bottom (hatched): -0.23,-0.25 0.48,-0.97 3.49,-0.97 3.51,-0.97 3.53,-0.99 23.55,-0.99 24.36,-0.18 24.36,27.64 24.23,27.76 -0.23,27.76
GND1  (via drill 0.35)
  other vias: 3.88,19.12
GNDA  (via drill 0.35)
  Top 0.254: C39.2 C38.2 | PS5.3 26.16,16.97 26.36,16.76 C40.1 | D6.2 D1.2 | R1.2 35.78,8.44 35.76,8.46 | R1.2 35.73,7.57 34.98,7.57 | R1.2 35.78,6.92 35.76,6.91 35.74,6.91 | R1.2 35.83,7.57 36.37,7.57
  other vias: 27.84,2.51 37.03,2.54 32.31,2.51 28.37,15.85 28.09,21.23 37.64,19.58 34.26,9.68 36.14,11.89 52.93,5.36 61.9,4.75 58.62,4.29 56.9,4.95 41.55,4.17 48.03,13.39 50.95,18.82 54.13,22.22 43.54,21.95 33.93,14.17 59.28,13.69 63.2,18.16 48.51,18.92 52.48,1.96
  pour Top (hatched): 25.5,0 64.97,0 64.97,26.8 25.5,26.8
  pour Bottom (hatched): 25.68,-1.45 64.06,-1.45 65.3,-0.2 65.3,27.43 25.5,27.43 25.5,-1.27
N$1
  Top 0.254: L4.1 30.19,13.3 30.03,13.45 C28.1 29.23,14.22 29.11,14.1 IC10.8 27.08,14.1 26.85,13.87 26.85,8.92 27,8.76 IC11.8 29.16,8.76 29.79,8.13 C30.1
N$2
  Top 0.254: IC10.6 29.06,11.56 29.36,11.25 29.36,9.93 29.64,9.65 R22.1
N$3
  Top 0.254: LED3.A 9.12,5.74 10.36,5.74 10.55,5.55 R38.2
N$4
  Top 0.254: R21.1 29.31,12.05 29.31,12.55 29.03,12.83 IC10.7
N$5
  Top 0.254: R2.2 44.7,15.75 46.16,17.21 S2.1
N$6  (via drill 0.35)
  Top 0.254: R5.2 46.74,15.34 v47.14,15.75
  Bottom 0.254: v47.14,15.75 51.11,15.75 51.31,15.95 S2.2
N$7  (via drill 0.35)
  Top 0.254: D6.1 54.61,14.94 | 54.61,14.94 54.61,18.85 54.84,19.08 55.63,19.86 RS485.2 | D5.3 v52.25,8.43 | v52.68,13.36 52.68,14.55 53.06,14.94 54.61,14.94
  Bottom 0.254: v52.25,8.43 52.65,8.84 52.65,13.33 v52.68,13.36
N$9
  Top 0.254: LED1.A 1.7,3.25 2.87,2.08 R3.2
N$10
  Top 0.254: D4.3 52.2,3.35 52.57,2.98 54.53,2.98 | 54.53,2.98 D1.1 | RS485.3 63.27,16.05 63.55,15.77 63.55,1.52 63.17,1.14 55.09,1.14 54.53,1.7 54.53,2.98
N$15
  Top 0.254: R6.2 39.62,16.79 40.04,17.21 S1.1 S1.2
N$38
  Top 0.254: LED4.A 8.89,22.81 9.02,22.94 10.54,22.94 10.65,22.82 R37.2
N$43
  Top 0.254: C29.1 21.34,8.64 21.46,8.76 IC11.1 23.72,8.76 23.93,8.97 23.93,13.87 23.7,14.1 IC10.1 21.79,14.1 21.67,14.22 L3.2 21.11,13.98 21.11,13 21.06,12.95 C27.1
N$47
  Top 0.254: R35.1 21.44,10.16 21.61,10.34 21.61,11.35 21.82,11.56 IC10.3
N$48
  Top 0.254: R36.1 20.87,12.05 21.01,12.19 21.02,12.19 21.05,12.22 21.36,12.22 21.46,12.32 21.46,12.7 21.59,12.83 IC10.2
N$54
  Top 0.254: IC11.6 29.18,6.22 29.31,6.35 R24.1
N$64
  Top 0.254: R33.1 21.54,6.1 21.67,6.22 IC11.3
N$85
  Top 0.254: L12.2 16.8,21.36 | 16.8,21.36 16.8,22.14 16.91,22.25 C37.1 | PS5.2 23.62,20.9 23.16,21.36 16.8,21.36
N$86
  Top 0.254: C38.1 C39.1 35.46,19.02 35.23,18.8 R55.1 34.33,19.37 34.11,19.58 31.27,19.58 29.99,18.31 PS5.4
RX  (via drill 0.35)
  Top 0.254: R36.2 18.13,11.43 15.81,13.74 14.41,13.74 v14.15,14 | IC4.4 14.16,15.55 v14.15,15.55
  Bottom 0.254: v14.15,15.55 v14.15,14
RXD
  Top 0.254: IC2.1 35.97,9.02 35.54,9.45 35.54,10.64 35,11.18 R21.2
TX
  Top 0.254: R35.2 18.82,10.16 17.21,11.77 IC4.20
TXD  (via drill 0.35)
  Top 0.254: R22.2 33.02,9.65 33.27,9.4 v33.27,7.01 | v33.27,5.69 33.27,5.41 33.48,5.21 IC2.4
  Bottom 0.254: v33.27,7.01 v33.27,5.69
TXEN
  Top 0.254: R24.2 34.04,6.35 34.33,6.64 | R1.1 34.33,6.64 | 34.33,6.64 34.62,6.35 35.71,6.35 35.87,6.5 37.4,6.5 | 37.4,6.5 IC2.3 | IC2.2 37.42,6.53 37.4,6.5
TXEN_
  Top 0.254: IC4.18 14.8,10.98 15.13,10.65 15.2,10.65 15.28,10.57 17.8,10.57 18.24,10.14 18.24,6.35 18.49,6.1 R33.2
VBUS
  Top 0.254: USB.A4_B9 6.36,15.61 5.89,15.14 5.16,15.14 4.88,14.86 4.88,11.58 5.53,10.94 6.16,10.94 6.29,10.81 USB.B4_A9
  Top 0.406: USB.B4_A9 8.75,10.81 9.11,10.44 F1.2
VCC
  Top 0.254: 36.02,13.21 Z3.1 38,13.21 38.29,12.91 C42.2 38.32,10.69 42.49,10.69 42.84,10.34 | 36.02,13.21 35.51,12.7 L4.2 | 36.02,13.21 35.46,13.77 C40.2 34.04,16.76 33.63,17.17 33.63,18.15 33.6,18.18 33.6,18.52 33.33,18.8 R55.2 | 42.84,10.34 IC2.8 | 42.84,10.34 42.86,10.34 43.64,11.12 44.48,11.12 44.7,11.35 | R2.1 44.7,11.35 | 44.7,11.35 44.93,11.12 48.29,11.12 48.41,11 51.87,11 52.17,11.3 52.17,11.91 52.43,12.17 56.82,12.17 57.25,11.73 57.25,7.31 57.71,6.86 59.87,6.86 | 59.87,6.86 61.54,6.86 POWER.2 | POWER.3 60.55,2.84 59.87,3.53 59.87,6.86

### Text on the board
bNames: G | B | A | G | 5V | 5V